# Altium schematic sheet System Control - Power Supervisors.SchDoc
size B
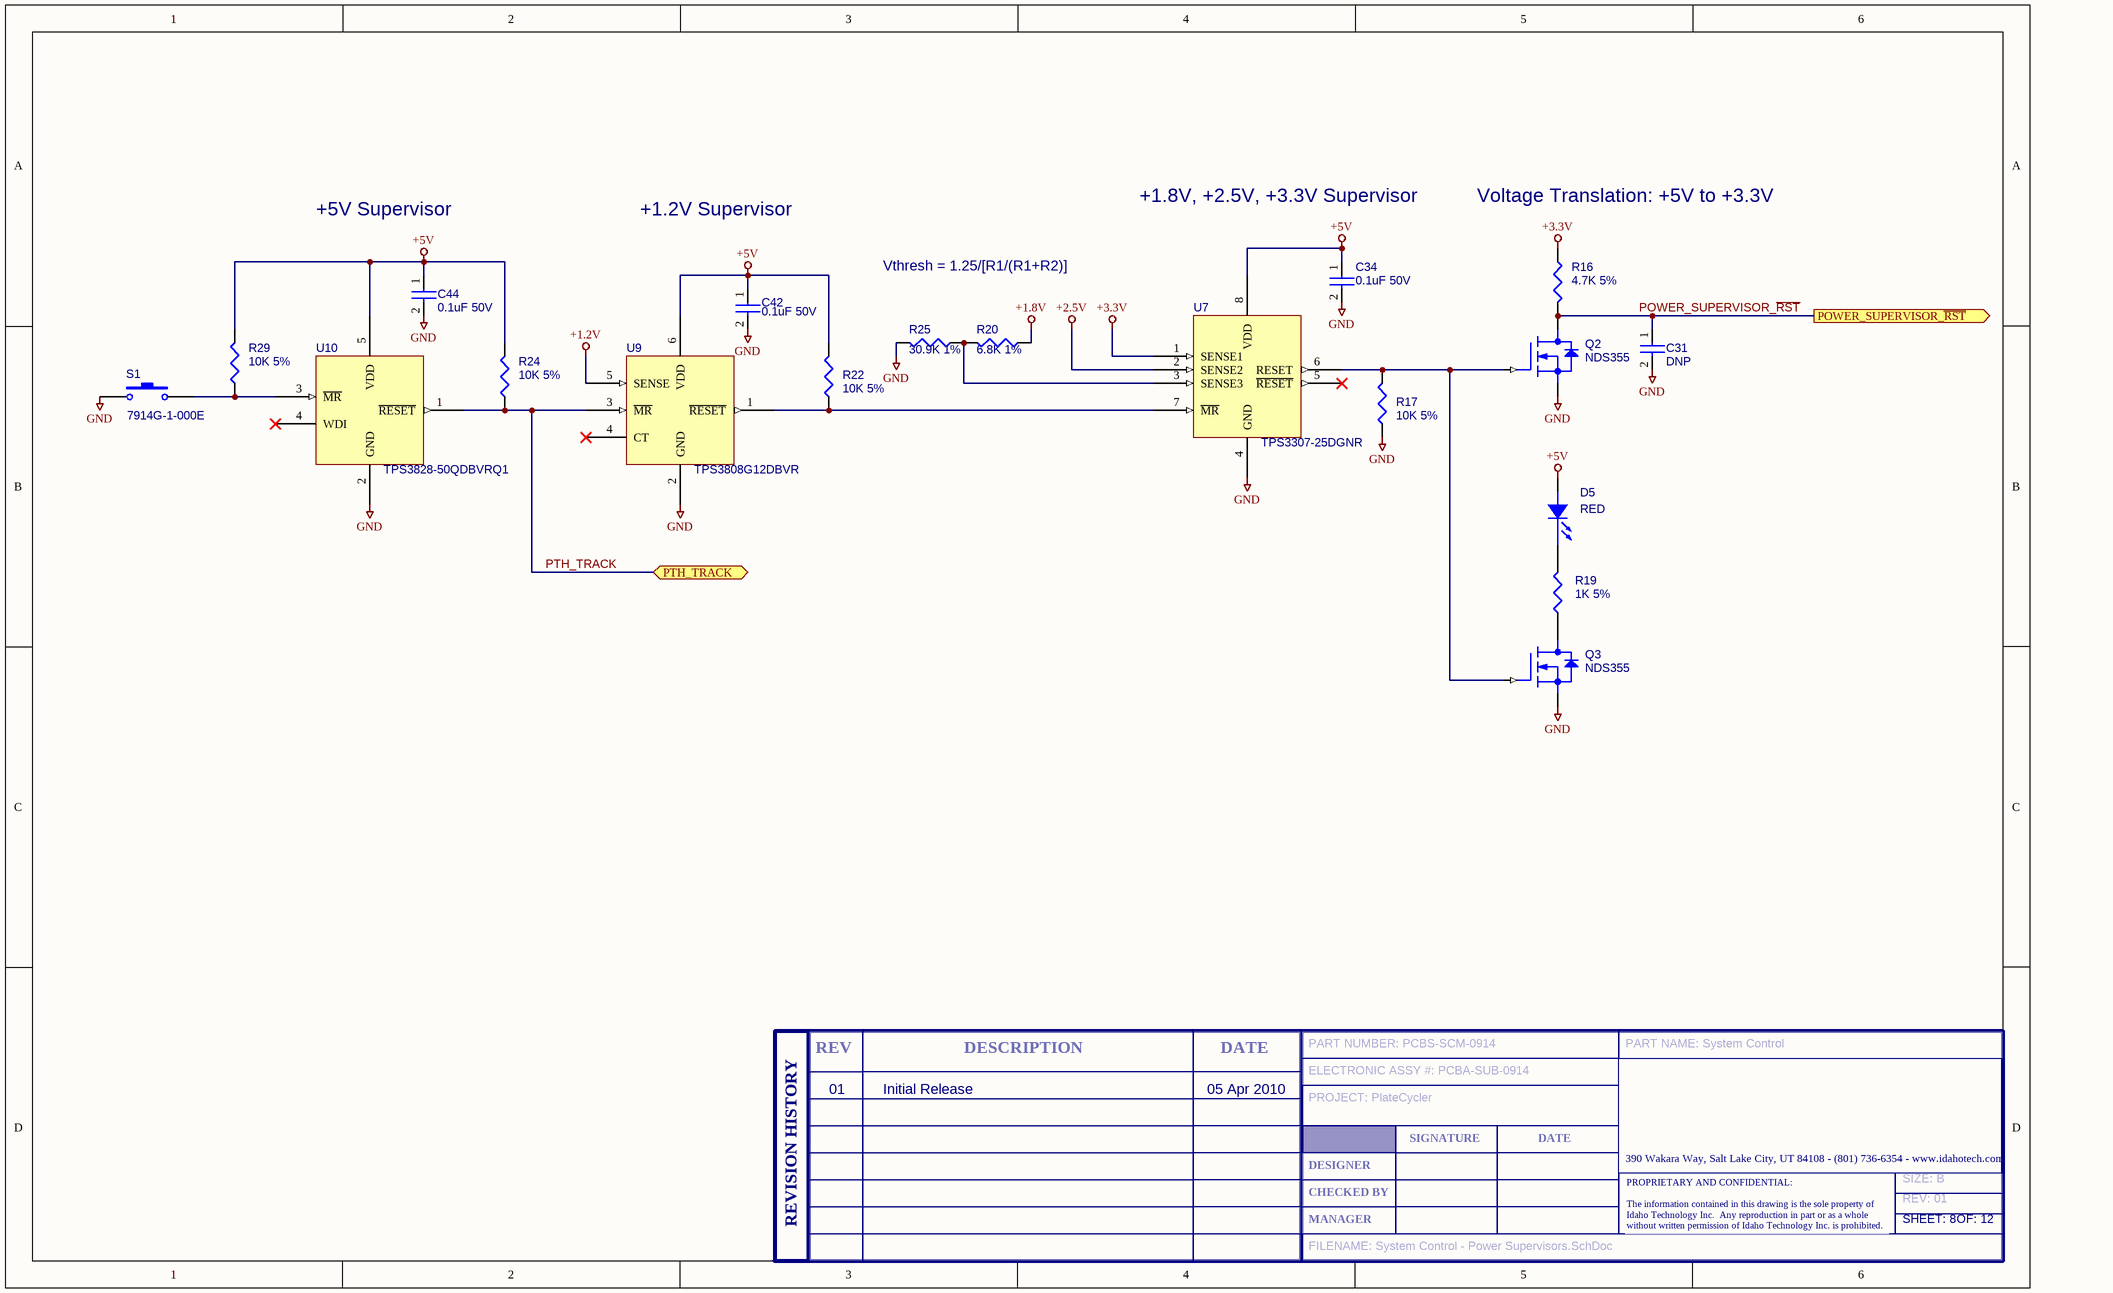
[diagram p0: System Control - Power Supervisors.SchDoc]

## Parts
C31  DNP  [SM/C_0603]  (no BOM)
C34  0.1uF 50V  [SM/C_0603]
C42  0.1uF 50V  [SM/C_0603]
C44  0.1uF 50V  [SM/C_0603]
D5  RED  [LED 1206]
Q2  NDS355  [TO236AA/SOT23]
Q3  NDS355  [TO236AA/SOT23]
R16  4.7K 5%  [SM/R_0603]
R17  10K 5%  [SM/R_0603]
R19  1K 5%  [SM/R_0603]
R20  6.8K 1%  [SM/R_0603]
R22  10K 5%  [SM/R_0603]
R24  10K 5%  [SM/R_0603]
R25  30.9K 1%  [SM/R_0603]
R29  10K 5%  [SM/R_0603]
S1  Manufacturer P/N: 7914G-1-000E  [PBSW SMD]  (hidden comment: SW-PB)
T?  SIZE: B  REV: 01  FILENAME: System Control - Power Supervisors.SchDoc  PART NUMBER: PCBS-SCM-0914  PART NAME: System Control  ELECTRONIC ASSY #: PCBA-SUB-0914  PROJECT: PlateCycler  SHEET: 8  OF: 12  (hidden comment: ITI Title Block, A Size)  (graphical)
U7  TPS3307-25DGNR  [MSOP8 PowerPAD]
U9  TPS3808G12DBVR  [SOT23-6]
U10  TPS3828-50QDBVRQ1  [SOT23-5]

## Ports
POWER_SUPERVISOR_~{RST} (out), PTH_TRACK

## Nets
+1.2V: U9.5(SENSE)
+1.8V: R20.1
+2.5V: U7.2(SENSE2)
+3.3V: R16.1 U7.1(SENSE1)
+5V: C34.1 C42.1 C44.1 D5.1(ANODE) R22.2 R24.2 R29.2 U7.8(VDD) U9.6(VDD) U10.5(VDD)
GND: C31.2 C34.2 C42.2 C44.2 Q2.2(SOURCE) Q3.2(SOURCE) R17.1 R25.2 S1.1 U7.4(GND) U9.2(GND) U10.2(GND)
POWER_SUPERVISOR_~{RST}: C31.1 Q2.3(DRAIN) R16.2 ; port POWER_SUPERVISOR_~{RST}
PTH_TRACK: R24.1 U9.3(~{MR}) U10.1(~{RESET}) ; port PTH_TRACK
NetD5_2: D5.2(CATHODE) R19.2
NetQ2_1: Q2.1(GATE) Q3.1(GATE) R17.2 U7.6(RESET)
NetQ3_3: Q3.3(DRAIN) R19.1
NetR20_2: R20.2 R25.1 U7.3(SENSE3)
NetR22_1: R22.1 U7.7(~{MR}) U9.1(~{RESET})
NetR29_1: R29.1 S1.2 U10.3(~{MR})

Not connected (* = marked no-connect by the designer): U7 5(~{RESET})*; U9 4(CT)*; U10 4(WDI)*

## Notes on the sheet
- +5V Supervisor
- +1.2V Supervisor
- +1.8V, +2.5V, +3.3V Supervisor
- Voltage Translation: +5V to +3.3V
- Vthresh = 1.25/[R1/(R1+R2)]
- 01
- Initial Release
- 05 Apr 2010
- (in symbol ITI A-size Title Block and Rev Table) REV; DESCRIPTION; DATE; SIGNATURE; 390 Wakara Way, Salt Lake City, UT 84108 - (801) 736-6354 - www.idahotech.com; DESIGNER; CHECKED BY; REVISION HISTORY; MANAGER; PROPRIETARY AND CONFIDENTIAL: / The information contained in this drawing is the sole property of / Idaho Technology Inc.  Any reproduction in part or as a whole / without written permission of Idaho Technology Inc. is prohibited.

## Library data of the parts
C31 C34 C42 C44 = CAP NP_1: CAP CER .10UF 50V X7R 0603; Manufacturer P/N: UMK107B7104KA-T; Manufacturer: Taiyo Yuden; Vendor P/N: 587-1243-1-ND; Vendor: Digikey
D5 = LED: LED 635NM RED WTR CLR 1206 SMD; Manufacturer: Lumex; Manufacturer P/N: SML-LX1206IC-TR; Vendor: Digikey; Vendor P/N: 67-1356-1-ND
Q2 Q3 = NDS355N/SOT: MOSFET N-CH 30V 1.6A SOT-23; Manufacturer: Fairchild Semiconductor; Vendor: Digikey; Vendor P/N: NDS355NCT-ND; Manufacturer P/N: NDS355N
R16 = R4.7K 5% 0603: RES 4.7K OHM 1/10W 5% 0603 SMD; Manufacturer P/N: ERJ-3GEYJ472V; Manufacturer: Panasonic; Vendor: Digikey; Vendor P/N: P4.7KGCT-ND
R17 R22 R24 R29 = R10K 5% 0603: RES 10K OHM 1/10W 5% 0603 SMD; Manufacturer: Panasonic; Manufacturer P/N: ERJ-3GEYJ103V; Vendor: Digikey; Vendor P/N: P10KGCT-ND
R19 = R1K 5% 0603: RES 1.0K OHM 1/10W 5% 0603 SMD; Manufacturer: Panasonic; Manufacturer P/N: ERJ-3GEYJ102V; Vendor: Digikey; Vendor P/N: P1.0KGCT-ND
R20 = R1K 5% 0603: RES 6.80K OHM 1/10W 1% 0603 SMD; Manufacturer: Panasonic; Manufacturer P/N: ERJ-3EKF6801V; Vendor: Digikey; Vendor P/N: P6.80KHCT-ND
R25 = R1K 5% 0603: RES 30.9K OHM 1/10W 1% 0603 SMD; Manufacturer: Panasonic; Manufacturer P/N: ERJ-3EKF3092V; Vendor: Digikey; Vendor P/N: P30.9KHCT-ND
S1 = SW-PB: SWITCH KEY 4MM SQ SMD GULL WING; Manufacturer: Bourns; Vendor P/N: 7914G-000ECT-ND; Vendor: Digikey
T? = ITI A-size Title Block and Rev Table: ITI Title Block and Rev Table, A Size
U7 = TPS3307-25DGNR: IC 3.3/2.5V/ADJ TPL MONIT 8-MSOP; Manufacturer: Texas Instruments; Vendor P/N: 296-3313-1-ND; Vendor: Digikey; Manufacturer P/N: TPS3307-25DGNR
U9 = TPS3808G12DBVR: IC VOLT SUPERVISOR 1.2V SOT23-6; Manufacturer: Texas Instruments; Vendor P/N: 296-17190-1-ND; Vendor: Digikey; Manufacturer P/N: TPS3808G12DBVR
U10 = TPS3828-50QDBVRQ1: IC 4.55V SUPPLY MONITOR SOT23-5; Manufacturer: Texas Instrument; Vendor P/N: 296-15659-1-ND; Vendor: Digikey; Manufacturer P/N: TPS3828-50QDBVRQ1